# Altium schematic sheet Supply.SchDoc
size A3; SheetNumber: 1; SheetTotal: 1; PageSetup: Record=PageOptions|CenterHorizontal=True|CenterVertical=True|PrintScale=0.97|XCorrection=1.00|YCorrection=1.00|PrintKind=1|BorderSize=5000000|LeftOffset=0|BottomOffset=0|Orientation=2|PaperLength=2970|PaperWidth=2100|Scale=100|PaperSource=7|PrintQuality=600|MediaType=1|DitherType=10|PaperKind=A4|PrintScaleMode=1
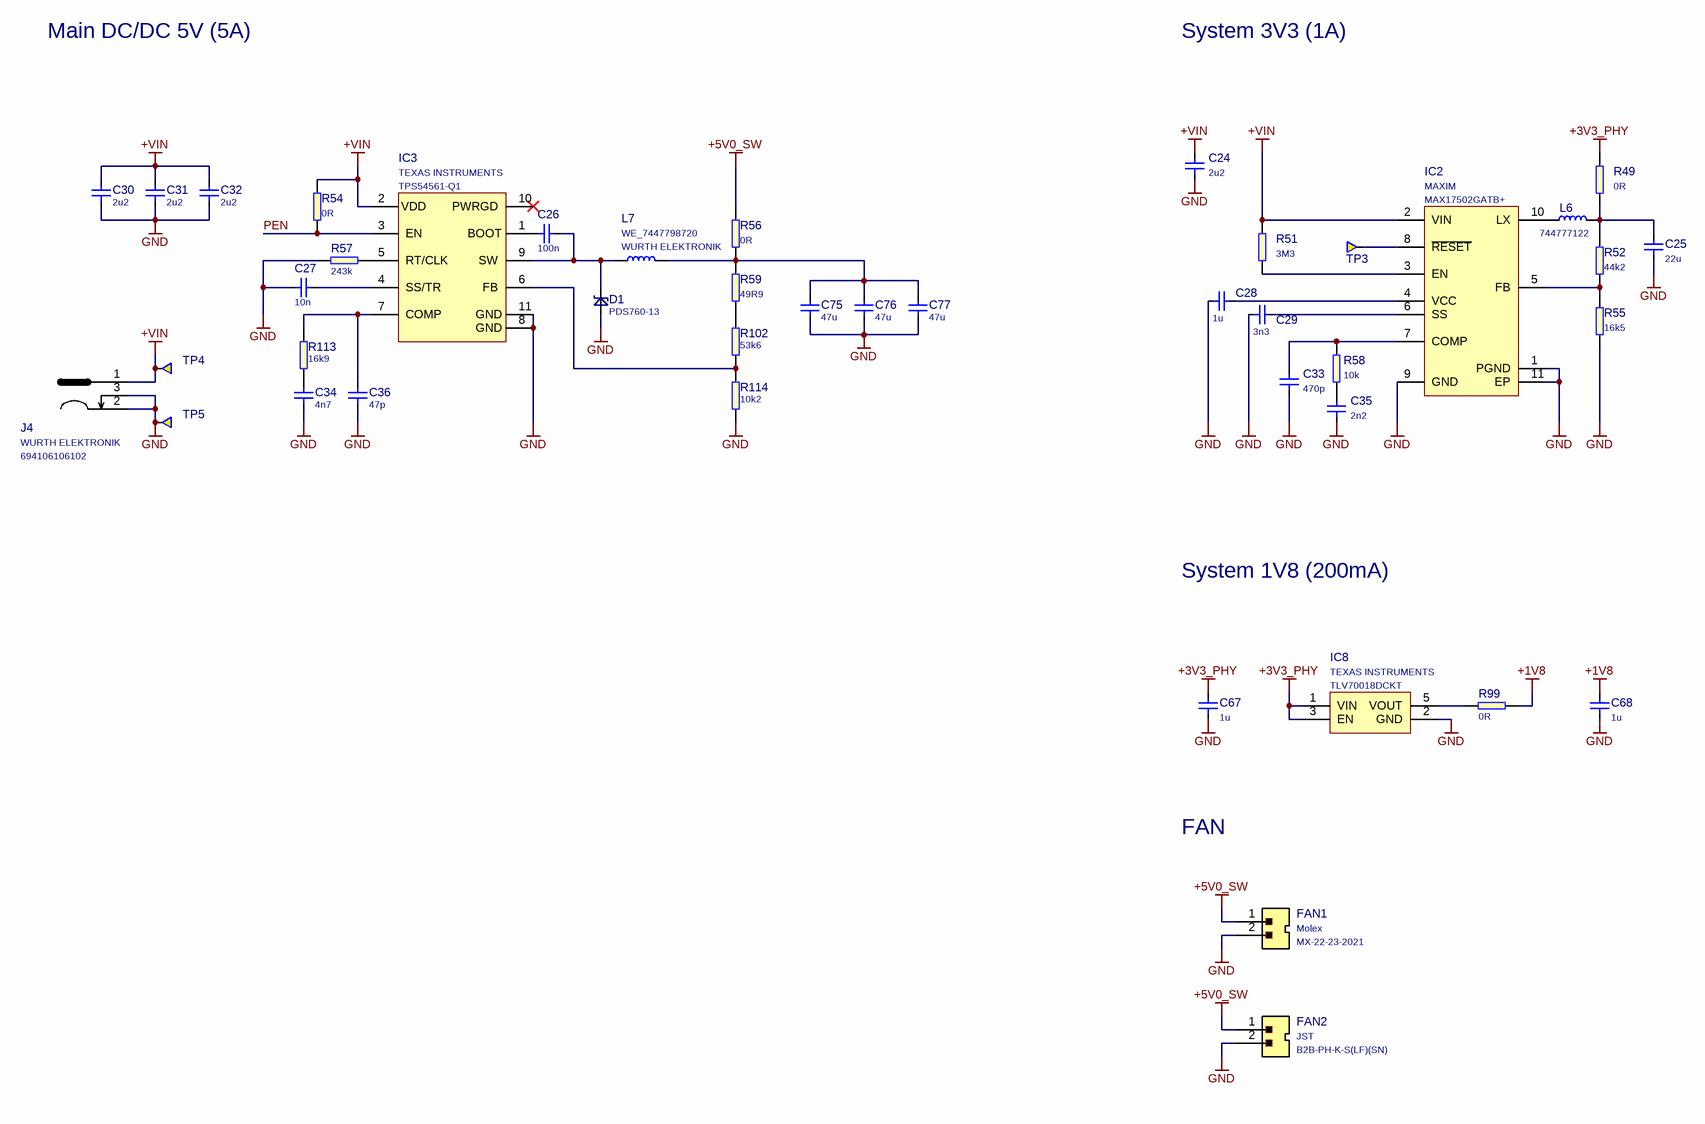
[diagram p0: Supply.SchDoc]

## Parts
C24  2u2  [1210]
C25  22u  [1210]
C26  100n  [0603]
C27  10n  [0402]
C28  1u  [C_0402]
C29  3n3  [0603]
C30  2u2  [1206]
C31  2u2  [1206]
C32  2u2  [1206]
C33  470p  [0603]
C34  4n7  [0402]
C35  2n2  [0603]
C36  47p  [0402]
C67  1u  [C_0402]
C68  1u  [C_0402]
C75  47u  [0805]
C76  47u  [0805]
C77  47u  [0805]
D1  PDS760-13  [PowerDI]
FAN1  Manufacturer: Molex  [molex_2223-2021]  (hidden comment: MX-22-23-2021)
FAN2  B2B-PH-K-S(LF)(SN)  Manufacturer: JST  [B2B-PH-K-S(LF)(SN)]
IC2  MAX17502GATB+  Manufacturer: MAXIM  [10-TDFN]
IC3  TPS54561-Q1  Manufacturer: TEXAS INSTRUMENTS  [WSON-10_4x4]
IC8  TLV70018DCKT  Manufacturer: TEXAS INSTRUMENTS  [SC70-5]
J4  Manufacturer: WURTH ELEKTRONIK  [694106106102]  (hidden comment: 694106106102)
L6  744777122  [WE_744777122]
L7  Manufacturer: WURTH ELEKTRONIK  [WE_7447798720]  (hidden comment: WE_7447798720)
R49  0R  [0805]
R51  3M3  [0402]
R52  44k2  [0402]
R54  0R  [0402]
R55  16k5  [0402]
R56  0R  [1206]
R57  243k  [0402]
R58  10k  [0402]
R59  49R9  [0402]
R99  0R  [0603]
R102  53k6  [0402]
R113  16k9  [0402]
R114  10k2  [0402]
TP3  (no value)  [TP-R-2.5]  (no BOM)
TP4  Testpad  [TP-R-1.5]  (value not drawn)  (no BOM)
TP5  Testpad  [TP-R-1.5]  (value not drawn)  (no BOM)

## Nets
+1V8: C68.2 R99.2
+3V3_PHY: C67.2 IC8.1(VIN) IC8.3(EN) R49.2
+5V0_SW: FAN1.1 FAN2.1 R56.2
+VIN: C24.2 C30.2 C31.2 C32.2 IC2.2(VIN) IC3.2(VDD) J4.1 R51.2 R54.2 TP4.1
GND: C24.1 C25.1 C27.1 C28.1 C29.1 C30.1 C31.1 C32.1 C33.1 C34.1 C35.1 C36.1 C67.1 C68.1 C75.1 C76.1 C77.1 D1.A FAN1.2 FAN2.2 IC2.1(PGND) IC2.9(GND) IC2.11(EP) IC3.8(GND) IC3.11(GND) IC8.2(GND) J4.2 J4.3 R55.1 R57.2 R114.1 TP5.1
PEN: IC3.3(EN) R54.1
NetC25_2: C25.2 L6.2 R49.1 R52.2
NetC26_1: C26.1 IC3.1(BOOT)
NetC26_2: C26.2 D1.C IC3.9(SW) L7.1
NetC27_2: C27.2 IC3.4(SS/TR)
NetC28_2: C28.2 IC2.4(VCC)
NetC29_2: C29.2 IC2.6(SS)
NetC33_2: C33.2 IC2.7(COMP) R58.2
NetC34_2: C34.2 R113.1
NetC35_2: C35.2 R58.1
NetC36_2: C36.2 IC3.7(COMP) R113.2
NetC75_2: C75.2 C76.2 C77.2 L7.2 R56.1 R59.2
NetIC2_3: IC2.3(EN) R51.1
NetIC2_5: IC2.5(FB) R52.1 R55.2
NetIC2_8: IC2.8(~{RESET}) TP3.1
NetIC2_10: IC2.10(LX) L6.1
NetIC3_5: IC3.5(RT/CLK) R57.1
NetIC3_6: IC3.6(FB) R102.1 R114.2
NetIC8_5: IC8.5(VOUT) R99.1
NetR59_1: R59.1 R102.2

Not connected (* = marked no-connect by the designer): IC3 10(PWRGD)*

## Notes on the sheet
- Main DC/DC 5V (5A)
- System 3V3 (1A)
- System 1V8 (200mA)
- FAN
- Title:
- Size:
- Date:
- Status:
- A3
- Revision:
- Page:
- of
- Antmicro Ltd
- www.antmicro.com
- File:

## Library data of the parts
C24 = C_2u2_1210: MLCC SMT Capacitor 2u2F 1210; Value: 2u2; PartNumber: C_2u2_1210
C25 = C_22u_1210: MLCC SMT Capacitor 22uF 1210; Value: 22u; PartNumber: C_22u_1210
C26 = C_100n_0603: MLCC SMT Capacitor 100nF 0603; Manufacturer: AVX; PartNumber: C_100n_0603; Value: 100n
C27 = C_10n_0402: MLCC SMT Capacitor 10nF 0402; Manufacturer: AVX; PartNumber: C_10n_0402; Value: 10n
C28 C67 C68 = C_1u_0402: MLCC SMT Capacitor 1uF 0402; Value: 1u; PartNumber: C_1u_0402
C29 = C_3n3_0603: MLCC SMT Capacitor 3n3F 0603; Value: 3n3; PartNumber: C_3n3_0603
C30-C32 = C_2u2_1206: MLCC SMT Capacitor 2u2F 1206; Manufacturer: Kemet; PartNumber: C_2u2_1206; Value: 2u2
C33 = C_470p_0603: MLCC SMT Capacitor 470pF 0603; Value: 470p; PartNumber: C_470p_0603
C34 = C_4n7_0402: MLCC SMT Capacitor 4n7F 0402; Manufacturer: TDK; PartNumber: C_4n7_0402; Value: 4n7
C35 = C_2n2_0603: MLCC SMT Capacitor 2n2F 0603; Value: 2n2; PartNumber: C_2n2_0603
C36 = C_47p_0402: MLCC SMT Capacitor 47pF 0402; Manufacturer: KEMET; PartNumber: C_47p_0402; Value: 47p
C75-C77 = C_47u_0805: MLCC SMT Capacitor 47uF 0805; Manufacturer: KEMET; PartNumber: C_47u_0805; Value: 47u
D1 = PDS760-13: Schottky Diodes & Rectifiers SCHOTTKY RECTIFIER; Manufacturer: DIODES INC.; PartNumber: PDS760-13; Value: PDS760-13
FAN1 = molex_2223-2021: Pinhead connector with key; PartNumber: 022232021 A-6373-02A222; Value: MX-22-23-2021
IC2 = MAX17502GATB+: DC-DC Switching (Step Down) Regulator, Adjustable, 600 kHz, 4.5V-60Vin, 0.9V-55.2V/1 A out, TDFN-10; Value: MAX17502GATB+; PartNumber: MAX17502GATB+
IC3 = TPS54561-Q1: IC REG BCK SPLIT RAIL ADJ 10WSON; PartNumber: TPS54561-Q1; Value: TPS54561-Q1
IC8 = TLV70018DCKT: Voltage Regulator, 2V to 5.5V, 175mV Dropout, 1.8Vout, 200mAout; PartNumber: TLV70018DCKT; Value: TLV70018DCKT
J4 = WE-694106106102: DC Power Jack Right Angled SMT Ø6.4 with 4 soldering pads & pegs WR-DC; Value: 694106106102; PartNumber: 694106106102
L6 = 744777122: Surface Mount Power Inductor, WE-PD Series, 22 µH, 1.41 A, 1.7 A, Shielded, 0.11 ohm; Manufacturer: WURTH ELEKTRONIK; Value: 744777122; PartNumber: 744777122
L7 = WE_7447798720: Fixed Inductors WE-PDF 1064 7.2uH 7.9A 12.8mOhm; PartNumber: WE_7447798720; Value: WE_7447798720
R49 = R_0R_0805: SMT Resistor 0R 0805; PartNumber: R_0R_0805; Value: 0R
R51 = R_3M3_0402: SMT Resistor 3M3 0402; Value: 3M3; PartNumber: R_3M3_0402
R52 = R_44k2_0402: SMT Resistor 0402; Value: 44k2; PartNumber: R_44k2_0402
R54 = R_0R_0402: SMT Resistor 0402; PartNumber: R_0R_0402; Value: 0R
R55 = R_16k5_0402_0.1%: RES, 16k5, 0402, 0.1%; Value: 16k5; PartNumber: R_16k5_0402_0.1%
R56 = R_0R_1206: RES, 0R, 1206; PartNumber: R_0R_1206; Value: 0R
R57 = R_243k_0402: RES, 243k, 0402; PartNumber: R_243k_0402; Value: 243k
R58 = R_10k_0402: SMT Resistor 0402; Value: 10k; PartNumber: R_10k_0402
R59 = R_49R9_0402: RES, 49R9, 0402; PartNumber: R_49R9_0402; Value: 49R9
R99 = R_0R_0603: SMT Resistor 0R 0603; PartNumber: R_0R_0603; Value: 0R
R102 = R_53k6_0402: SMT Resistor 0402; Manufacturer: TE CONNECTIVITY; PartNumber: R_53k6_0402; Value: 53k6
R113 = R_16k9_0402: SMT Resistor 0402; Manufacturer: PANASONIC; PartNumber: R_16k9_0402; Value: 16k9
R114 = R_10k2_0402_0.1%: RES, 10k2, 0402, 0.1%; Manufacturer: TE CONECTIVITY; PartNumber: R_10k2_0402_0.1%; Value: 10k2
TP3 = TP-R-2.5: Testpad, round, 2mm; PartNumber: Testpad
TP4 TP5 = TP-R-1.5: Testpad, round, 1.5mm; PartNumber: Testpad
FAN2 = B2B-PH-K-S(LF)(SN): PartNumber: B2B-PH-K-S(LF)(SN); Value: B2B-PH-K-S(LF)(SN)